# Altium schematic sheet integradorleg.SchDoc
size A
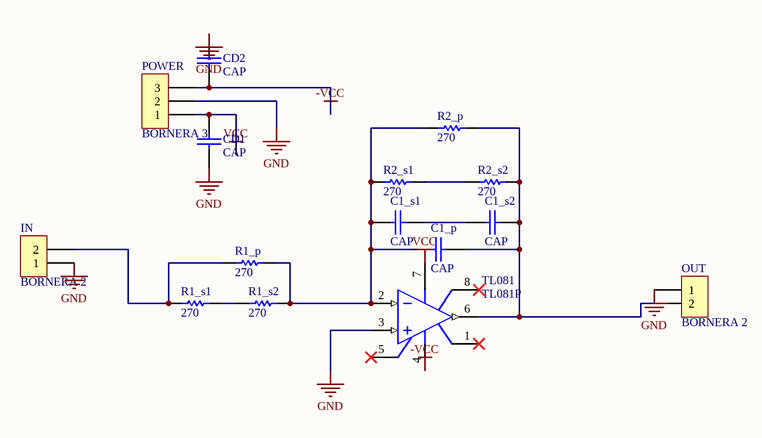
[diagram p0: integradorleg.SchDoc]

## Parts
C1_p  CAP  [0805]
C1_s1  CAP  [0805]
C1_s2  CAP  [0805]
CD1  CAP  [0805]
CD2  CAP  [0805]
IN  BORNERA 2  [BORNERA2]
OUT  BORNERA 2  [BORNERA2]
POWER  BORNERA 3  [BORNERA3]
R1_p  270  [0805]
R1_s1  270  [0805]
R1_s2  270  [0805]
R2_p  270  [0805]
R2_s1  270  [0805]
R2_s2  270  [0805]
TL081  TL081P  [P008]

## Nets
-VCC: CD2.2 POWER.3 TL081.4(V-)
GND: CD1.2 CD2.1 IN.1 OUT.1 POWER.2 TL081.3(IN+)
VCC: CD1.1 POWER.1 TL081.7(V+)
NetC1_p_1: C1_p.1 C1_s1.1 R1_p.2 R1_s2.2 R2_p.1 R2_s1.1 TL081.2(IN-)
NetC1_p_2: C1_p.2 C1_s2.2 OUT.2 R2_p.2 R2_s2.2 TL081.6(OUT)
NetC1_s1_2: C1_s1.2 C1_s2.1
NetIN_2: IN.2 R1_p.1 R1_s1.1
NetR1_s1_2: R1_s1.2 R1_s2.1
NetR2_s1_2: R2_s1.2 R2_s2.1

Not connected (* = marked no-connect by the designer): TL081 1(OS_TRIM)* 5(OS_TRIM)* 8(NC)*

## Library data of the parts
R1_p R1_s1 R1_s2 R2_p R2_s1 R2_s2 = RES
TL081 = TL081P: JFET-Input Operational Amplifier; Note: Pin 8 is not connected; Published: 16-Jan-2001; LatestRevisionDate: 04-Mar-2005; LatestRevisionNote: Stylized 3D Model Added.; DatasheetVersion: Feb-1999; PackageVersion: Jun-1999; PackageReference: P008; Publisher: Altium Limited; PackageDescription: DIP; 8 Leads; Row Spacing 7.62 mm; Pitch 2.54 mm; Code_JEDEC: MO-001-AN; ComponentLink1Description: Manufacturer Link; ComponentLink1URL: http://www.ti.com/; ComponentLink2Description: Datasheet; ComponentLink2URL: http://www-s.ti.com/sc/ds/tl081.pdf